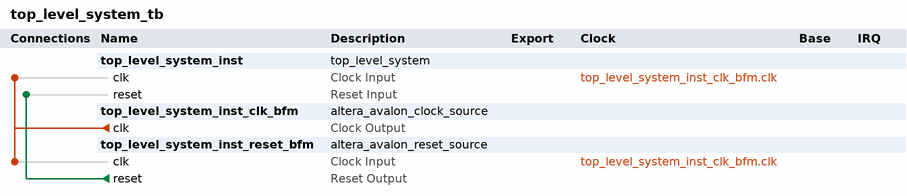
[diagram p0: system contents]
# Platform Designer (Qsys) system top_level_system_tb, MAX 10 10M50DAF484C6GES
# Parameters at their usual value, and those the tool derives, are not listed.
package require -exact qsys 18.0
create_system top_level_system_tb
set_project_property DEVICE_FAMILY {MAX 10}
set_project_property DEVICE 10M50DAF484C6GES

add_instance top_level_system_inst top_level_system 1.0

add_instance top_level_system_inst_clk_bfm altera_avalon_clock_source 18.0

add_instance top_level_system_inst_reset_bfm altera_avalon_reset_source 18.0
set_instance_parameter_value top_level_system_inst_reset_bfm ASSERT_HIGH_RESET 0
set_instance_parameter_value top_level_system_inst_reset_bfm INITIAL_RESET_CYCLES 50

# connections
add_connection top_level_system_inst_clk_bfm.clk top_level_system_inst.clk clock
add_connection top_level_system_inst_clk_bfm.clk top_level_system_inst_reset_bfm.clk clock
add_connection top_level_system_inst_reset_bfm.reset top_level_system_inst.reset reset

set_interconnect_requirement {$system} qsys_mm.clockCrossingAdapter HANDSHAKE
set_interconnect_requirement {$system} qsys_mm.enableEccProtection FALSE
set_interconnect_requirement {$system} qsys_mm.insertDefaultSlave FALSE
set_interconnect_requirement {$system} qsys_mm.maxAdditionalLatency 1

save_system top_level_system_tb.qsys
